# Altium schematic sheet controler.SchDoc
size A4
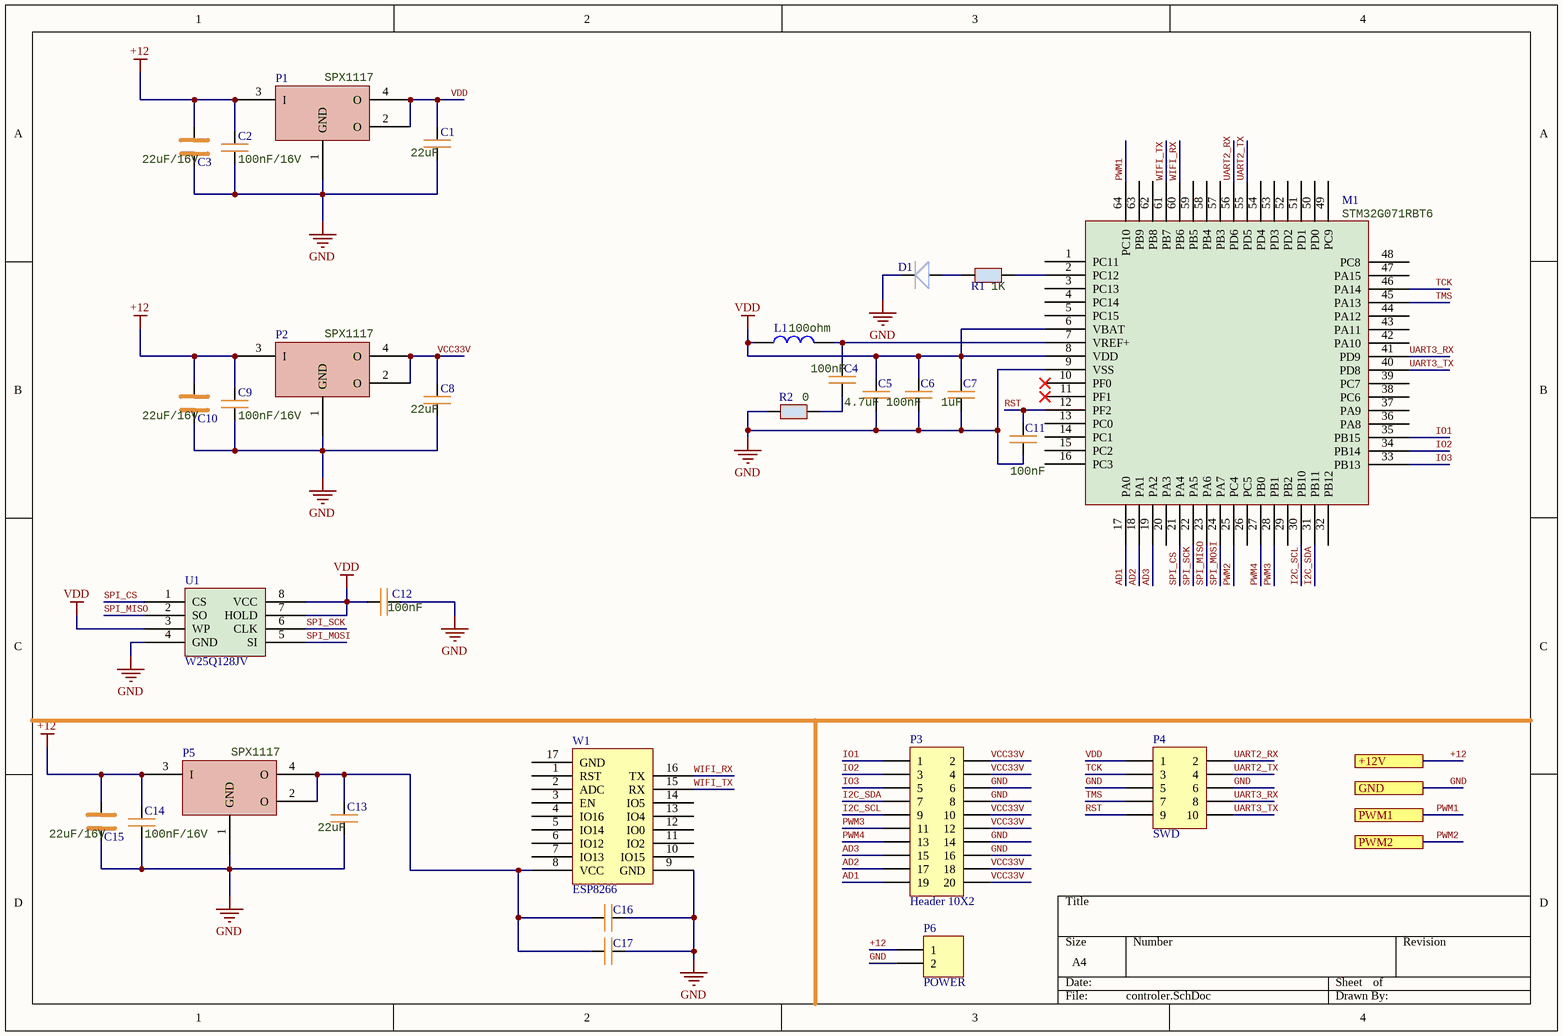
[diagram p0: controler.SchDoc]

## Parts
C1  22uF  [CAP0603]
C2  100nF/16V  [CAP0603]
C3  22uF/16V  [cap1210]
C4  100nF  [CAP0603]
C5  4.7uF  [CAP0603]
C6  100nF  [CAP0603]
C7  1uF  [CAP0603]
C8  22uF  [CAP0603]
C9  100nF/16V  [CAP0603]
C10  22uF/16V  [cap1210]
C11  100nF  [CAP0603]
C12  100nF  [CAP0603]
C13  22uF  [CAP0603]
C14  100nF/16V  [CAP0603]
C15  22uF/16V  [cap1210]
C16  CAP0603  [CAP0603]  (value not drawn)
C17  CAP0603  [CAP0603]  (value not drawn)
D1  led0603  [led0603]  (value not drawn)
L1  100ohm  [bead0603]
M1  Manufacturer Part Number: STM32G071RBT6  [STM32G071RB]  (hidden comment: controller)
P1  SPX1117  [1117]
P2  SPX1117  [1117]
P3  Header 10X2  [HDR2X10]
P4  SWD  [HDR2X5]
P5  SPX1117  [1117]
P6  POWER  [HDR1X2]
R1  1K  [res0603]
R2  0  [res0603]
U1  W25Q128JV  [W25Q128]
W1  ESP8266  [ESP-12S]

## Ports
+12V, GND, PWM1, PWM2

## Nets
+12: C2.2 C3.2 C9.2 C10.2 C14.2 C15.2 P1.3(I) P2.3(I) P5.3(I) P6.1 ; port +12V
GND: C1.1 C2.1 C3.1 C5.1 C6.1 C7.1 C8.1 C9.1 C10.1 C11.1 C12.1 C13.1 C14.1 C15.1 C16.2 C17.2 D1.1 M1.9(VSS) P1.1(GND) P2.1(GND) P3.6 P3.8 P3.14 P3.16 P4.5 P4.6 P5.1(GND) P6.2 R2.1 U1.4(GND) W1.9(GND) ; port GND
VDD: C1.2 C5.2 C6.2 C7.2 C12.2 L1.1 M1.6(VBAT) M1.8(VDD) P1.2(O) P1.4(O) P4.1 U1.3(WP) U1.7(HOLD) U1.8(VCC)
AD1: M1.17(PA0) P3.19
AD2: M1.18(PA1) P3.17
AD3: M1.19(PA2) P3.15
I2C_SCL: M1.30(PB10) P3.9
I2C_SDA: M1.31(PB11) P3.7
IO1: M1.35(PB15) P3.1
IO2: M1.34(PB14) P3.3
IO3: M1.33(PB13) P3.5
PWM1: M1.64(PC10) ; port PWM1
PWM2: M1.25(PC4) ; port PWM2
PWM3: M1.28(PB1) P3.11
PWM4: M1.27(PB0) P3.13
RST: C11.2 M1.12(PF2) P4.9
SPI_CS: M1.21(PA4) U1.1(CS)
SPI_MISO: M1.23(PA6) U1.2(SO)
SPI_MOSI: M1.24(PA7) U1.5(SI)
SPI_SCK: M1.22(PA5) U1.6(CLK)
TCK: M1.46(PA14) P4.3
TMS: M1.45(PA13) P4.7
UART2_RX: M1.56(PD6) P4.2
UART2_TX: M1.55(PD5) P4.4
UART3_RX: M1.41(PD9) P4.8
UART3_TX: M1.40(PD8) P4.10
VCC33V: C8.2 P2.2(O) P2.4(O) P3.2 P3.4 P3.10 P3.12 P3.18 P3.20
WIFI_RX: M1.60(PB6) W1.16(TX)
WIFI_TX: M1.61(PB7) W1.15(RX)
NetC4_1: C4.1 R2.2
NetC4_2: C4.2 L1.2 M1.7(VREF+)
NetC13_2: C13.2 C16.1 C17.1 P5.2(O) P5.4(O) W1.8(VCC)
NetD1_2: D1.2 R1.1
NetM1_2: M1.2(PC12) R1.2

Not connected (* = marked no-connect by the designer): M1 1(PC11) 3(PC13) 4(PC14) 5(PC15) 10(PF0)* 11(PF1)* 13(PC0) 14(PC1) 15(PC2) 16(PC3) 20(PA3) 26(PC5) 29(PB2) 32(PB12) 36(PA8) 37(PA9) 38(PC6) 39(PC7) 42(PA10) 43(PA11) 44(PA12) 47(PA15) 48(PC8) 49(PC9) 50(PD0) 51(PD1) 52(PD2) 53(PD3) 54(PD4) 57(PB3) 58(PB4) 59(PB5) 62(PB8) 63(PB9); W1 1(RST) 2(ADC) 3(EN) 4(IO16) 5(IO14) 6(IO12) 7(IO13) 10(IO15) 11(IO2) 12(IO0) 13(IO4) 14(IO5) 17(GND)

## Library data of the parts
C1 C2 C4-C9 C11-C14 = CAP0603
C3 C10 C15 = CAP1210
D1 = led0603: 这是一个二极管
L1 = bead0603: a bead
M1 = STM32G071RB: Manufacturer: STMicroelectronics; Supplier 1: Digi-Key; Stock 1: 974; Pricing 1: 1=3.13000, 10=2.80700, 160=2.29981, 640=1.95780, 1120=1.65116 (USD); ComponentLink1URL: https://media.digikey.com/pdf/Data%20Sheets/ST%20Microelectronics%20PDFS/STM32G071_Rev1_DS.pdf?src-supplier=Digi-Key; ComponentLink1Description: https://media.digikey.com/pdf/Data%20Sheets/ST%20Microelectronics%20PDFS/STM32G071_Rev1_DS.pdf?src-supplier=Digi-Key; ComponentLink2URL: http://datasheet.octopart.com/STM32G071RBT6-STMicroelectronics-datasheet-120241066.pdf?src-supplier=Future+Electronics; ComponentLink2Description: http://datasheet.octopart.com/STM32G071RBT6-STMicroelectronics-datasheet-120241066.pdf?src-supplier=Future+Electronics; ComponentLink3URL: http://datasheet.octopart.com/STM32G071RBT6-STMicroelectronics-datasheet-127822703.pdf?src-supplier=Future+Electronics; ComponentLink3Description: http://datasheet.octopart.com/STM32G071RBT6-STMicroelectronics-datasheet-127822703.pdf?src-supplier=Future+Electronics; ComponentLink4URL: http://datasheet.octopart.com/STM32G071RBT6-STMicroelectronics-datasheet-130125765.pdf?src-supplier=TME; ComponentLink4Description: http://datasheet.octopart.com/STM32G071RBT6-STMicroelectronics-datasheet-130125765.pdf?src-supplier=TME; Supplier Part Number 1: 497-18341-ND
P1 P2 P5 = SPX1117: LDO --> 3.3
P3 = Header 10X2: Header, 10-Pin, Dual row; LatestRevisionDate: 17-Jul-2002; LatestRevisionNote: Re-released for DXP Platform.; Publisher: Altium Limited
P4 = Header 5X2: Header, 5-Pin, Dual row; LatestRevisionDate: 17-Jul-2002; LatestRevisionNote: Re-released for DXP Platform.; Publisher: Altium Limited
P6 = Header 2: Header, 2-Pin; LatestRevisionDate: 17-Jul-2002; LatestRevisionNote: Re-released for DXP Platform.; Publisher: Altium Limited
R1 R2 = RES0603